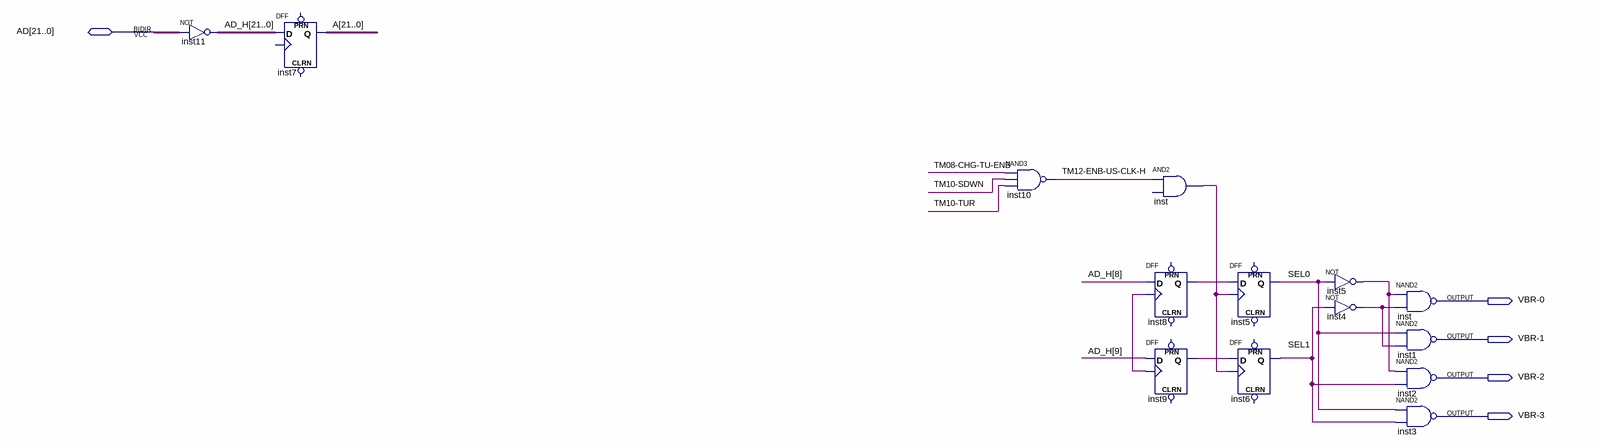
[diagram p0: schematic sheet]
// Quartus schematic mt_controller.bdf as structural Verilog: 14 symbols, 5 pins
module mt_controller (
  inout  [21:0] AD,
  output \VBR-0 ,
  output \VBR-1 ,
  output \VBR-2 ,
  output \VBR-3 
);

  wire inst4_out, inst5_out, inst8_q, inst9_q, inst_out, SEL0, SEL1, \TM08-CHG-TU-ENB , \TM10-SDWN ,
       \TM10-TUR , \TM12-ENB-US-CLK-H , undriven;
  wire [21:0] A, AD_H;

  assign AD_H = ~AD;  // NOT inst11, 22 bits wide
  DFF inst7[21:0] (.D(AD_H), .Q(A));  // open: CLRN, CLK, PRN
  nand inst10 (\TM12-ENB-US-CLK-H , \TM08-CHG-TU-ENB , \TM10-SDWN , \TM10-TUR );
  buf inst (inst_out, \TM12-ENB-US-CLK-H );  // AND2 open: IN2
  DFF inst8 (.CLK(undriven), .D(AD_H[8]), .Q(inst8_q));  // open: CLRN, PRN
  DFF inst9 (.CLK(undriven), .D(AD_H[9]), .Q(inst9_q));  // open: CLRN, PRN
  DFF inst5 (.CLK(inst_out), .D(inst8_q), .Q(SEL0));  // open: CLRN, PRN
  DFF inst6 (.CLK(inst_out), .D(inst9_q), .Q(SEL1));  // open: CLRN, PRN
  not inst5_dup2 (inst5_out, SEL0);
  not inst4 (inst4_out, SEL1);
  nand inst_dup2 (\VBR-0 , inst5_out, inst4_out);
  nand inst1 (\VBR-1 , SEL0, inst4_out);
  nand inst2 (\VBR-2 , inst5_out, SEL1);
  nand inst3 (\VBR-3 , SEL0, SEL1);
endmodule
